# Altium schematic sheet Alimentacion.SchDoc
size A4; Date: 11/03/2026; Author: Daniel Olsson & David Caballero; CompanyName: UPM; DrawnBy: David & Daniel; Engineer: David & Daniel; Organization: ETSIT; Revision: V1; SheetNumber: 2; SheetTotal: 2
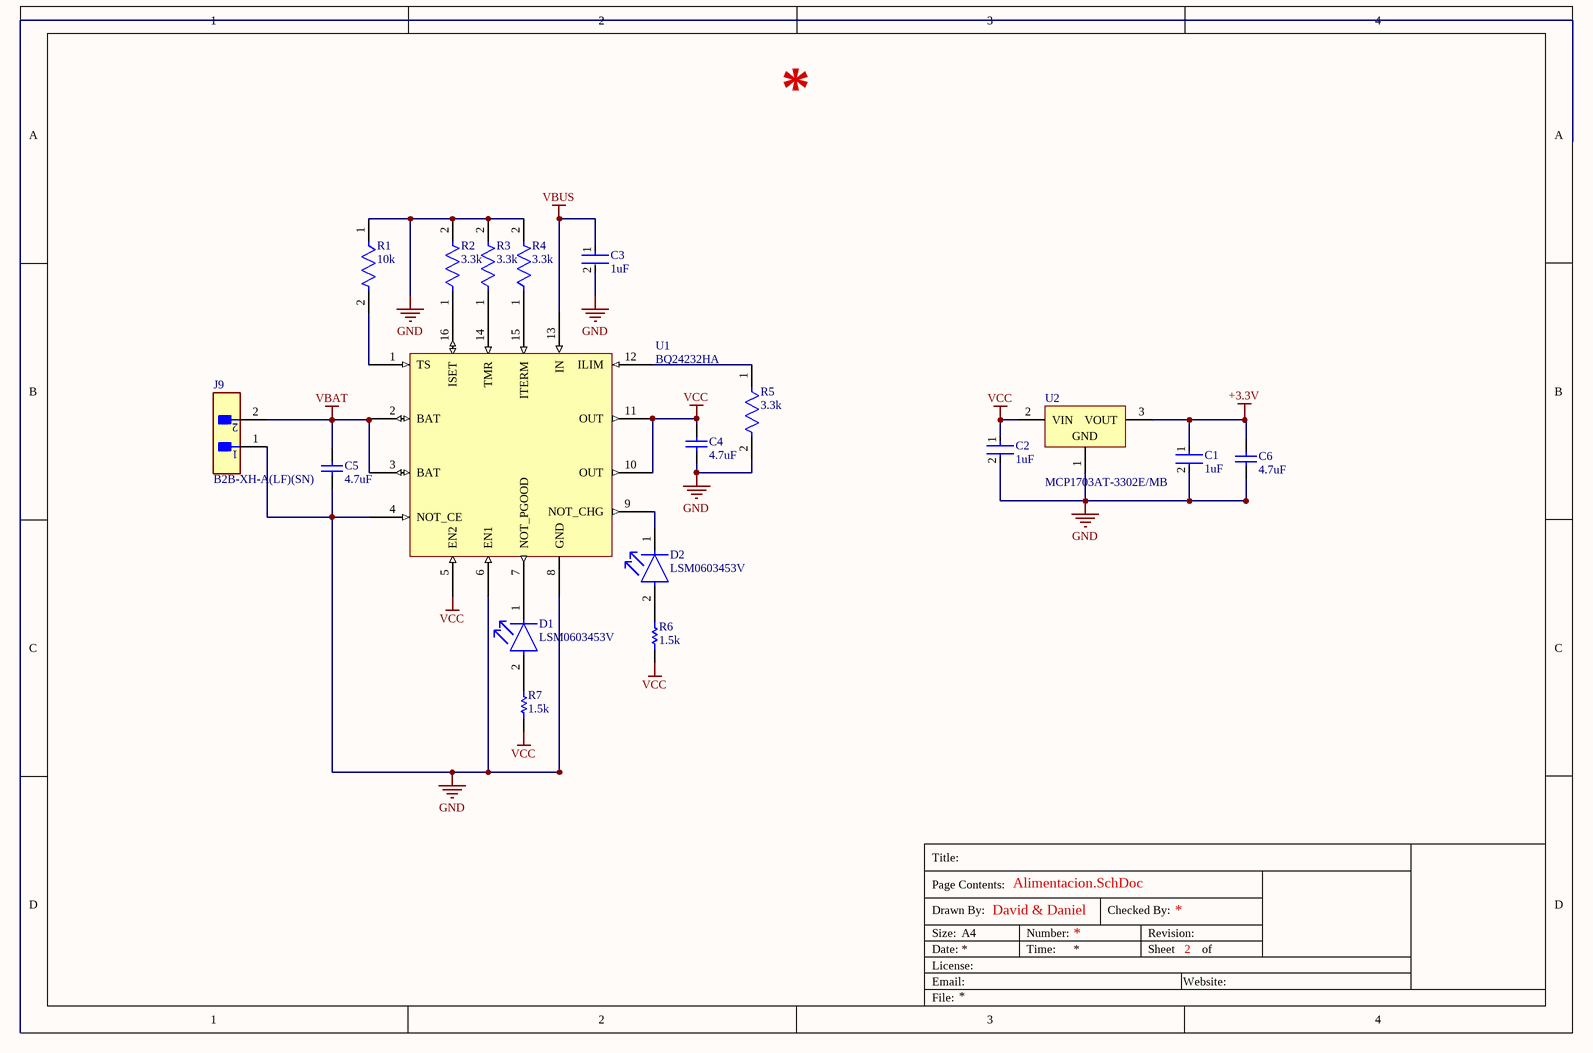
[diagram p0: Alimentacion.SchDoc]

## Parts
C1  1uF  [FP-CL10-IPC_C]
C2  1uF  [FP-CL10-IPC_C]
C3  1uF  [FP-CL10-IPC_C]
C4  4.7uF  [CAPC2014X150X70ML20]
C5  4.7uF  [CAPC2014X150X70ML20]
C6  4.7uF  [CAPC2014X150X70ML20]
D1  LSM0603453V  [FP-LSM0603453V-MFG]
D2  LSM0603453V  [FP-LSM0603453V-MFG]
J9  B2B-XH-A(LF)(SN)  [FP-B2B-XH-A_LF_SN-MFG]
R1  10k  [FP-CRCW0603-HPe3-MFG]
R2  3.3k  [FP-AC0603-IPC_C]
R3  3.3k  [FP-AC0603-IPC_C]
R4  3.3k  [FP-AC0603-IPC_C]
R5  3.3k  [FP-AC0603-IPC_C]
R6  1.5k  [RESC1608X55X25ML10T15]
R7  1.5k  [RESC1608X55X25ML10T15]
U1  BQ24232HA  [QFN50P300X300X100_HS-17N]
U2  MCP1703AT-3302E/MB  [MCHP-SOT-89-MB3_M]

## Nets
+3.3V: C1.1 C6.2 U2.3(VOUT)
GND: C1.2 C2.2 C3.2 C4.1 C5.1 C6.1 J9.1 R1.1 R2.2 R3.2 R4.2 R5.2 U1.4(NOT_CE) U1.6(EN1) U1.8(GND) U2.1(GND)
VBAT: C5.2 J9.2 U1.2(BAT) U1.3(BAT)
VBUS: C3.1 U1.13(IN)
VCC: C2.1 C4.2 R6.1 R7.1 U1.5(EN2) U1.10(OUT) U1.11(OUT) U2.2(VIN)
NetD1_1: D1.1(C) U1.7(NOT_PGOOD)
NetD1_2: D1.2(A) R7.2
NetD2_1: D2.1(C) U1.9(NOT_CHG)
NetD2_2: D2.2(A) R6.2
NetR1_2: R1.2 U1.1(TS)
NetR2_1: R2.1 U1.16(ISET)
NetR3_1: R3.1 U1.14(TMR)
NetR4_1: R4.1 U1.15(ITERM)
NetR5_1: R5.1 U1.12(ILIM)

## Notes on the sheet
- Title:
- Drawn By:
- Page Contents:
- Checked By:
- Size:
- Date:
- File:
- License:
- Email:
- A4
- Number:
- Time:
- Revision:
- Sheet
- Website:
- of

## Library data of the parts
C1-C3 = CMP-13271-002188-1: Cap Ceramic 1uF 16V X7R ±10% Pad SMD 0603 +125°C T/R; Width: 0.031inch; Max Operating Temperature: 125°C; Case/Package: 0603; Features: Soft Termination; Mount: Surface Mount; Min Operating Temperature: -55°C; Packaging: Tape and Reel; Dielectric: X7R; Voltage Rating: 16V; Capacitance: 1uF; Thickness: 0.035inch; Length: 0.063inch; Depth: 0.8mm; Lead Free: Lead Free; Tolerance: 10%; Ratings: AEC-Q200; Case Code (Imperial): 0603; Case Code (Metric): 1608
C4-C6 = CMP-2007-00037-1: Part Number: TACR475M010RTA; Manufacturer: AVX Interconnect / Elco
D1 D2 = CMP-00731-94024739-1: LSM0603453V LED SM 0603 3V -/1000/-mcd Green; Forward Current: 20mA; Forward Voltage: 2.3V; Viewing Angle: 120°; Reverse Voltage: 5V; Power Dissipation: 60mW; Wavelength: 576nm; Luminous Intensity: 120mcd; NexarPartId: 94024739; Height: 550µm; Max Operating Temperature: 85°C; Schedule B: 8541402000, 8541406050; Case/Package: 0603; Color: Green; Min Operating Temperature: -40°C
J9 = CMP-2000-05888-3: CONN HEADER VERT 2POS 2.5MM; Current Rating: 3A; Voltage Rating: 250V; Number of Contacts: 2; Contact Resistance: 20mR; Wire/Cable Gauge: 22AWG; Insulation Resistance: 1GR; Connector Type: Male Pin; Packaging: Bulk; Contact Material: Brass; Lead Free: Lead Free; Orientation: Straight; Contact Plating: Tin; Max Current Rating: 3A; Termination: Solder; Fastening Type: Detent; Depth: 5.75mm; Housing Material: Polyamide; REACH SVHC: No SVHC; Series: XH; Voltage Rating (AC): 250V; Number of Positions: 2; Color: Natural; Contact Type: Male Pin; Max Voltage Rating (DC): 250V; Pitch: 2.5mm; Lead Pitch: 2.5mm; Mount: Through Hole; Max Operating Temperature: 85°C; Length: 7.4mm; Max Voltage Rating (AC): 250V; Min Operating Temperature: -25°C; Number of Rows: 1; Housing Color: White
R1 = CMP-2000-03835-2: RES SMD 10K OHM 1% 1/3W 0603; Resistance: 10kR; Voltage Rating (DC): 75V; Max Power Dissipation: 250mW; Temperature Coefficient: 100ppm/°C; Case Code (Metric): 1608; Features: Automotive AEC-Q200; Termination: SMD/SMT; Number of Terminations: 2; Case Code (Imperial): 0603; Tolerance: 1%; Depth: 0.85mm; Package Quantity: 10; Length: 1.6mm; Packaging: Tape and Reel; Contact Plating: Tin; Radiation Hardening: No; Case/Package: 0603; Composition: Thick Film; Voltage Rating: 75V; Weight: 7.1E-05oz; Max Operating Temperature: 155°C; Lead Free: Lead Free; Width: 0.033inch; Power Rating: 250mW; Min Operating Temperature: -55°C; Military Standard: Not; Height: 0.45mm
R2-R5 = CMP-03412-041670-1: RES 3.3kΩ 1.00% 0.2W 0603; RoHS Compliant: Yes
R6 R7 = CMP-2000-04319-1: Part Number: RC0603JR-131K5L; Manufacturer: Yageo
U1 = BQ24232HA: USB-Friendly Lithium-Ion Battery Charger and Power-Path Management IC; ComponentLink1Description: New link; ComponentLink1URL: https://www.mouser.es/ProductDetail/Texas-Instruments/BQ24232HARGTR?qs=zEmsApcVOkUhMNqBs2s9Ww%3D%3D
U2 = CMP-0136-01169-1: 250 mA, 16V, Low Quiescent Current LDO Regulator, -40 to 125 degC, 3-pin SOT-89 (MB3), Tape and Reel; Manufacturer: Microchip; PackageVersion: C04-029B; ComponentLink3Description: Package Specification; PartNumber: MCP1703AT-3302E/MB; ComponentLink2URL: http://ww1.microchip.com/downloads/en/DeviceDoc/25122A.pdf; PackageDescription: 3-Lead Plastic Small Outline Transistor Header, 4.5 x 2.45 mm Body, 1.5 mm Pitch; PackageReference: SOT-89-MB3; ComponentLink1URL: http://www.microchip.com; ComponentLink2Description: Datasheet; ComponentLink3URL: http://www.microchip.com/stellent/groups/techpub_sg/documents/packagingspec/en012702.pdf; ComponentLink1Description: Manufacturer URL; ComponentLink4Description: Product URL; Mounting Technology: Surface Mount; DatasheetVersion: Rev. A; ComponentLink4URL: http://www.microchip.com/MCP1703A